# EAGLE design Camera (EAGLE 9.6.2)
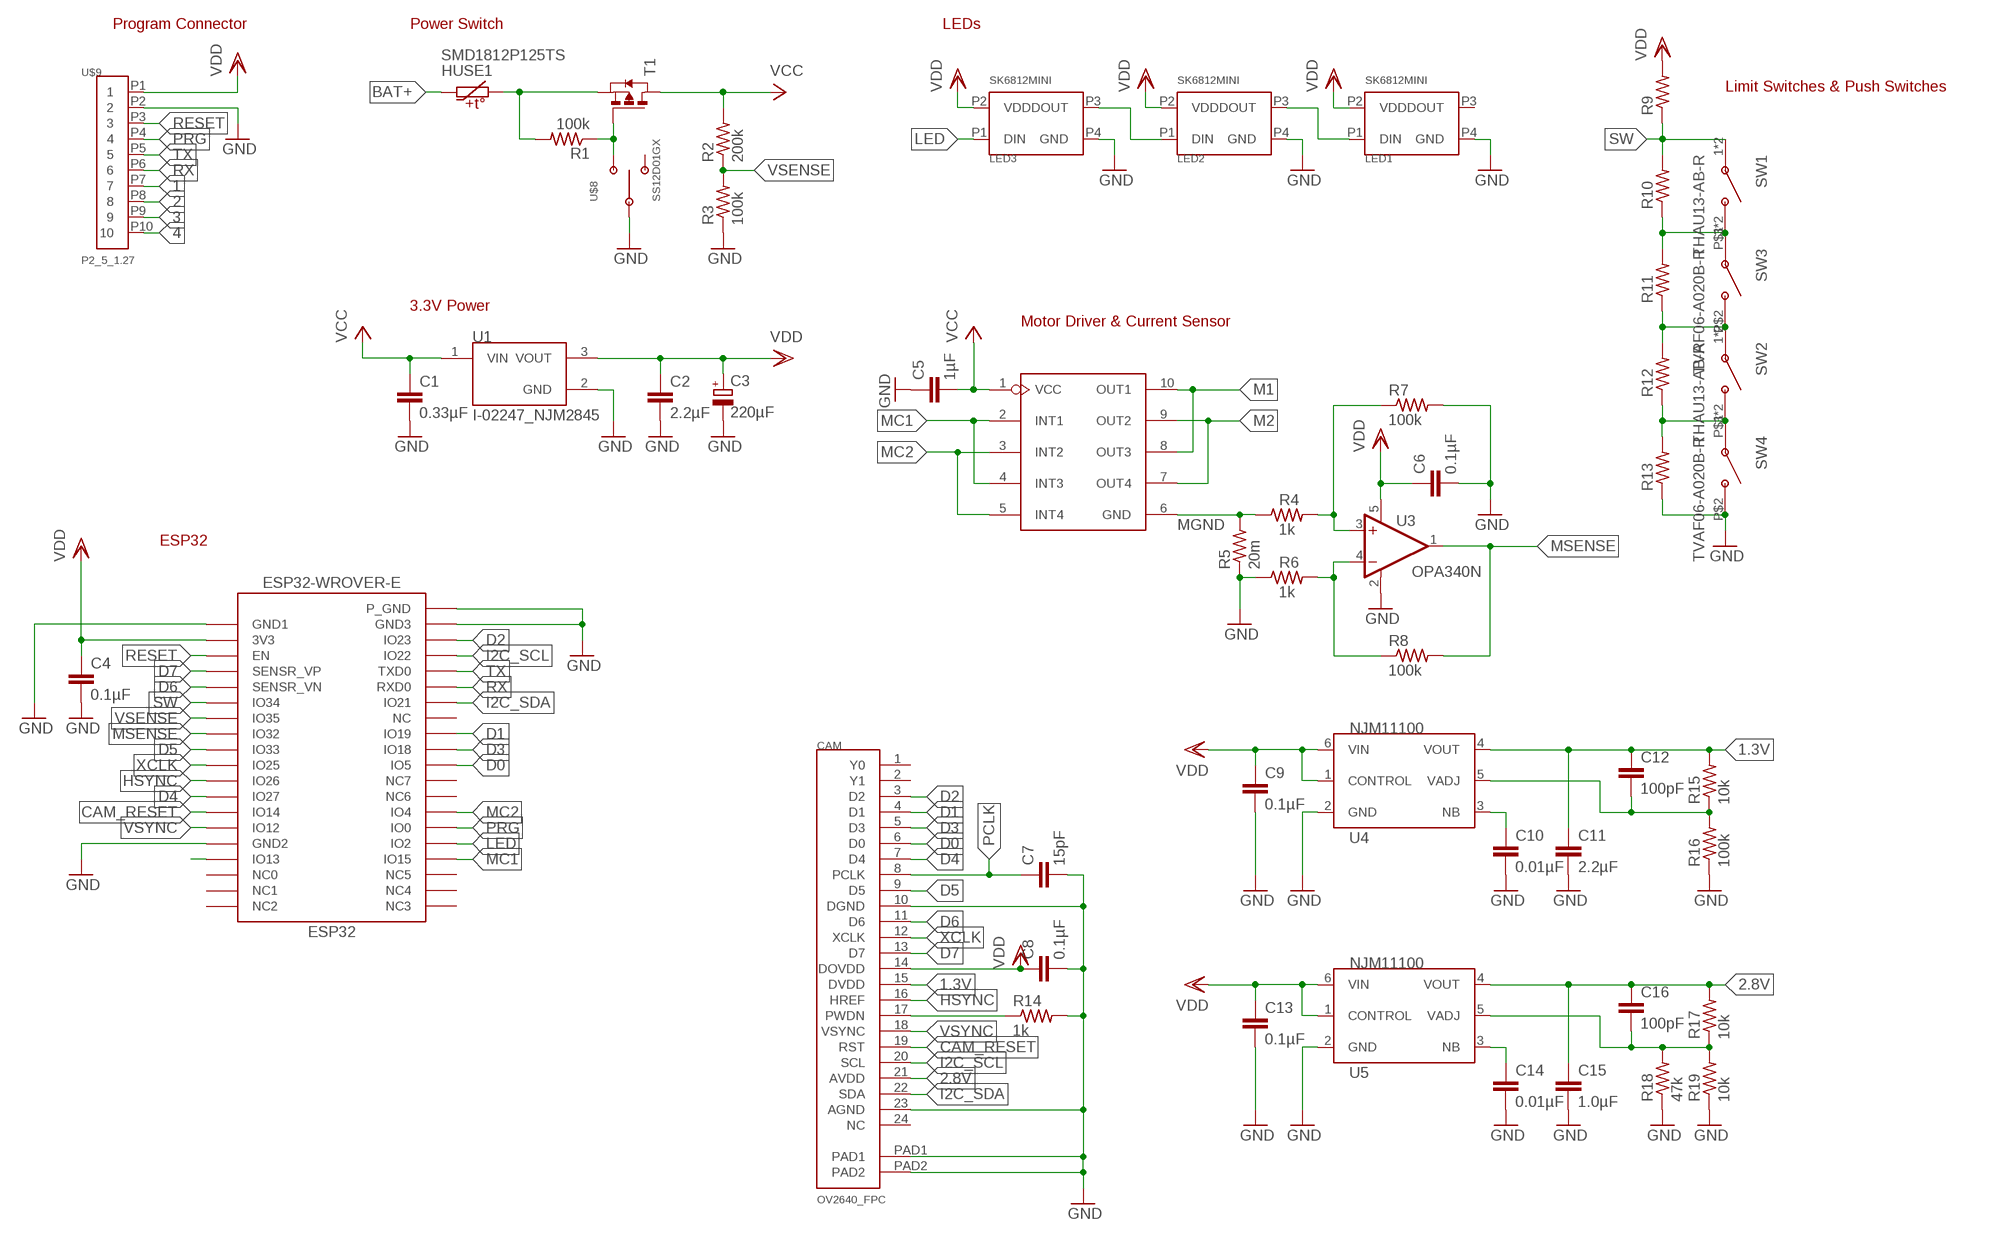
[diagram p0: schematic, sheet 1]

## Parts
C1  0.33µF  C-EUC0603  [C0603]
C2  2.2µF  C-EUC0603  [C0603]
C3  220µF  CPOL-EUUD-6,3X7,7  [UD-6,3X7,7_NICHICON]
C4  0.1µF  C-EUC0603  [C0603]
C5  1µF  C-EUC0603  [C0603]
C6  0.1µF  C-EUC0603  [C0603]
C7  15pF  C-EUC0603  [C0603]
C8  0.1µF  C-EUC0603  [C0603]
C9  0.1µF  C-EUC0603  [C0603]
C10  0.01µF  C-EUC0603  [C0603]
C11  2.2µF  C-EUC0603  [C0603]
C12  100pF  C-EUC0603  [C0603]
C13  0.1µF  C-EUC0603  [C0603]
C14  0.01µF  C-EUC0603  [C0603]
C15  1.0µF  C-EUC0603  [C0603]
C16  100pF  C-EUC0603  [C0603]
CAM  OV2640_FPC  [FH12-24S-0.5SH]
ESP32  ESP32-WROVER-E  [ESP32-WROVER-E]
HUSE1  SMD1812P125TS  [SMD1812P]
LED1  SK6812MINI  [SK68XXMINI]
LED2  SK6812MINI  [SK68XXMINI]
LED3  SK6812MINI  [SK68XXMINI]
R1  100k  R-US_R0603  [R0603]
R2  200k  R-US_R0603  [R0603]
R3  100k  R-US_R0603  [R0603]
R4  1k  R-US_R0603  [R0603]
R5  20m  R-US_R6332W  [R6332W]
R6  1k  R-US_R0603  [R0603]
R7  100k  R-US_R0603  [R0603]
R8  100k  R-US_R0603  [R0603]
R9  R-US_R0603  [R0603]
R10  R-US_R0603  [R0603]
R11  R-US_R0603  [R0603]
R12  R-US_R0603  [R0603]
R13  R-US_R0603  [R0603]
R14  1k  R-US_R0603  [R0603]
R15  10k  R-US_R0603  [R0603]
R16  100k  R-US_R0603  [R0603]
R17  10k  R-US_R0603  [R0603]
R18  47k  R-US_R0603  [R0603]
R19  10k  R-US_R0603  [R0603]
SW1  THAU13-AB-R  [THAU13-AB-R]
SW2  THAU13-AB-R  [THAU13-AB-R]
SW3  TVAF06-A020B-R  [TVAF06-A020B-R]
SW4  TVAF06-A020B-R  [TVAF06-A020B-R]
T1  PMOSSOT23  [SOT-23]
U1  I-02247_NJM2845  [TO252]
U2  DRIVER-LV8548MC-AH(SOIC10)  [SOIC10-1.0-5X4MM]
U3  OPA340N  [SOT23-5]
U4  NJM11100  [SOT95P240X110-6N]
U5  NJM11100  [SOT95P240X110-6N]
U$8  SS12D01GX  [SS12D01GX]
U$9  P2_5_1.27  [P2_5_1.27]

## Nets
1: U$9.P7
1.3V: C11.1 C12.1 CAM.15(DVDD) R15.2 U4.4(VOUT)
2: U$9.P8
2.8V: C15.1 C16.1 CAM.21(AVDD) R17.2 U5.4(VOUT)
3: U$9.P9
4: U$9.P10
BAT+: HUSE1.1
CAM_RESET: CAM.19(RST) ESP32.IO14
D0: CAM.6(D0) ESP32.IO5
D1: CAM.4(D1) ESP32.IO19
D2: CAM.3(D2) ESP32.IO23
D3: CAM.5(D3) ESP32.IO18
D4: CAM.7(D4) ESP32.IO27
D5: CAM.9(D5) ESP32.IO33
D6: CAM.11(D6) ESP32.SENSOR_VN(SENSR_VN)
D7: CAM.13(D7) ESP32.SENSOR_VP(SENSR_VP)
GND: C1.2 C2.2 C3.- C4.2 C5.1 C6.2 C7.2 C8.2 C9.2 C10.2 C11.2 C13.2 C14.2 C15.2 CAM.10(DGND) CAM.23(AGND) CAM.PAD1 CAM.PAD2 ESP32.GND1 ESP32.GND2 ESP32.GND3 ESP32.P_GND LED1.P4(GND) LED2.P4(GND) LED3.P4(GND) R3.1 R5.1 R6.1 R7.2 R13.1 R14.2 R16.1 R18.1 R19.1 SW4.P$2(B) U1.2(GND) U3.2(V-) U4.2(GND) U5.2(GND) U$8.2(C) U$9.P2
HSYNC: CAM.16(HREF) ESP32.IO26
I2C_SCL: CAM.20(SCL) ESP32.IO22
I2C_SDA: CAM.22(SDA) ESP32.IO21
LED: ESP32.IO2 LED3.P1(DIN)
M1: U2.8(OUT3) U2.10(OUT1)
M2: U2.7(OUT4) U2.9(OUT2)
MC1: ESP32.IO15 U2.2(INT1) U2.4(INT3)
MC2: ESP32.IO4 U2.3(INT2) U2.5(INT4)
MGND: R4.1 R5.2 U2.6(GND)
MSENSE: ESP32.IO32 R8.2 U3.1(OUT)
N$1: C10.1 U4.3(NB)
N$2: C12.2 R15.1 R16.2 U4.5(VADJ)
N$3: C14.1 U5.3(NB)
N$4: C16.2 R17.1 R18.2 R19.2 U5.5(VADJ)
N$7: CAM.17(PWDN) R14.1
N$10: ESP32.IO13
N$14: HUSE1.2 R1.2 T1.2(S)
N$15: R6.2 R8.1 U3.4(-IN)
N$16: R4.2 R7.1 U3.3(+IN)
N$17: R1.1 T1.3(G) U$8.1(A)
N$18: LED2.P1(DIN) LED3.P3(DOUT)
N$19: LED1.P1(DIN) LED2.P3(DOUT)
N$20: R11.1 R12.2 SW2.1(A) SW2.2(A) SW3.P$2(B)
N$21: R10.1 R11.2 SW1.3(B) SW1.4(B) SW3.P$1(A)
N$22: R12.1 R13.2 SW2.3(B) SW2.4(B) SW4.P$1(A)
PCLK: C7.1 CAM.8(PCLK)
PRG: ESP32.IO0 U$9.P4
RESET: ESP32.EN U$9.P3
RX: ESP32.RXD0 U$9.P6
SW: ESP32.IO34 R9.1 R10.2 SW1.1(A) SW1.2(A)
TX: ESP32.TXD0 U$9.P5
VCC: C1.1 C5.2 R2.2 T1.1(D) U1.1(VIN) U2.1(VCC)
VDD: C2.1 C3.+ C4.1 C6.1 C8.1 C9.1 C13.1 CAM.14(DOVDD) ESP32.3V3 LED1.P2(VDD) LED2.P2(VDD) LED3.P2(VDD) R9.2 U1.3(VOUT) U3.5(V+) U4.1(CONTROL) U4.6(VIN) U5.1(CONTROL) U5.6(VIN) U$9.P1
VSENSE: ESP32.IO35 R2.1 R3.2
VSYNC: CAM.18(VSYNC) ESP32.IO12
XCLK: CAM.12(XCLK) ESP32.IO25
Unconnected: CAM.1(Y0) CAM.2(Y1) CAM.24(NC) ESP32.IO16(NC6) ESP32.IO17(NC7) ESP32.NC ESP32.NC0 ESP32.NC1 ESP32.NC2 ESP32.NC3 ESP32.NC4 ESP32.NC5 LED1.P3(DOUT) U$8.3(B)

## Notes on the sheet
- Program Connector | Power Switch | LEDs
- Limit Switches & Push Switches
- 3.3V Power
- Motor Driver & Current Sensor
- ESP32

## Library data of the parts
C1 C2 C4-C8 = rcl:C-EU: CAPACITOR, European symbol; SPICEPREFIX: C
C3 = rcl:CPOL-EU: POLARIZED CAPACITOR, European symbol; SPICEPREFIX: C
C9-C16 = resistor:C-EU: CAPACITOR, European symbol
CAM = camera:OV2640_FPC
ESP32 = esp32:ESP32-WROVER-E
HUSE1 = ptc:SMD1812P125TS
LED1-LED3 = leds:SK6812MINI
R1-R14 = rcl:R-US_: RESISTOR, American symbol; SPICEPREFIX: R
R15-R19 = resistor:R-US_: RESISTOR, American symbol
SW1 SW2 = switches:THAU13-AB-R
SW3 SW4 = switches:TVAF06-A020B-R
T1 = zetex:PMOSSOT23: MOS FET; OC_FARNELL: unknown; OC_NEWARK: unknown
U1 = akizuki:I-02247_NJM2845
U2 = DRIVER-LV8548MC-AH_SOIC10_:DRIVER-LV8548MC-AH(SOIC10): 310030259 Check prices <https://pricing.snapeda.com/parts/LV8548MC-AH/ON%20Semiconductor/view-part?ref=eda>; AVAILABILITY: Not in stock; DESCRIPTION: Half Bridge (4) Driver DC Motors, General Purpose, Stepper Motors DMOS 10-SOIC; MF: ON Semiconductor; MP: LV8548MC-AH; PACKAGE: SOIC NB-10 ON Semiconductor; PRICE: None
U3 = burr-brown:OPA340: Rail-to-Rail Operational Amplifiers Single-Supply, MicroAmplifier(TM) Series; MPN: OPA340NA/3KG4; OC_FARNELL: 1234805; OC_NEWARK: 13M5177
U4 U5 = regulators:NJM11100
U$8 = switches:SS12D01GX
U$9 = pins:P2_5_1.27

## Board
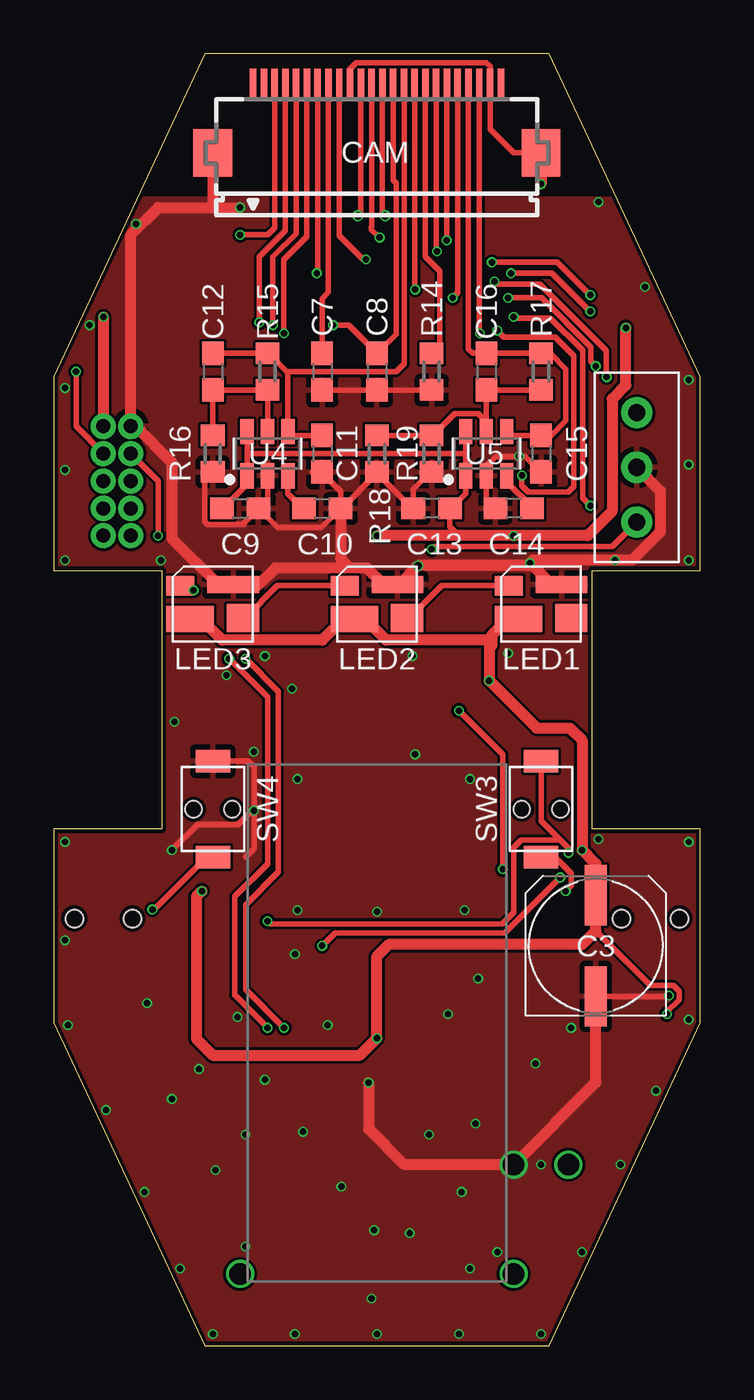
[diagram p1: board, top side]
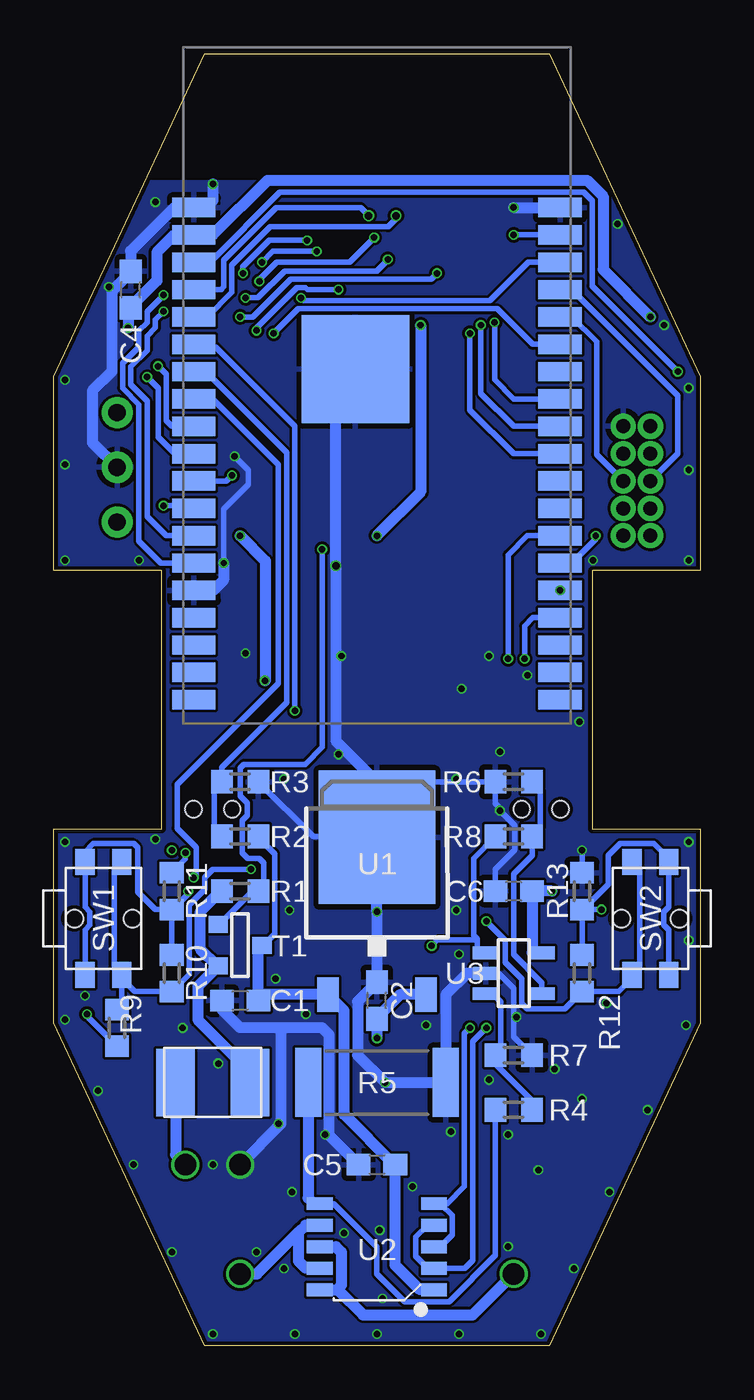
[diagram p2: board, bottom side, seen from below]

Size 30 x 60 mm. Coordinates in mm from the lower left corner, seen from the top.
Outline: 7,0 23,0 30,15 30,24 25,24 25,36 30,36 30,45 23,60 7,60 0,45 0,36 5,36 5,24 0,24 0,15 7,0
Copper layers (1*16): Top 0.035mm / dielectric 1mm / Bottom 0.035mm
Design rules "jlcpcb-2layers-1.0mm": minimum track width 5mil, minimum drill 0.3mm, track to track 5mil, track to pad 5mil, pad to pad 5mil, via to via 5mil, smd to smd 5mil, copper to edge 0.2mm, drill to drill 6mil, minimum pad ring 10mil, minimum via ring 3mil, stop-mask expansion 4mil, vias tented up to drill 0mil, thermal gap 10mil
tKeepout: area -35,27.5 to 65,32.5

### Footprints (pad centres in the part's own frame; a part is rotated, then mirrored left to right if it is on the bottom)
C0603 = smd 1.1 x 1: 1 -0.85,0; 2 0.85,0
UD-6,3X7,7_NICHICON = smd 2.8 x 1: + 2.35,0; - -2.35,0
FH12-24S-0.5SH = smd 0.3 x 1.3: 1 -5.75,3.25; 2 -5.25,3.25; 3 -4.75,3.25; 4 -4.25,3.25; 5 -3.75,3.25; 6 -3.25,3.25; 7 -2.75,3.25; 8 -2.25,3.25; 9 -1.75,3.25; 10 -1.25,3.25; 11 -0.75,3.25; 12 -0.25,3.25; 13 0.25,3.25; 14 0.75,3.25; 15 1.25,3.25; 16 1.75,3.25; 17 2.25,3.25; 18 2.75,3.25; 19 3.25,3.25; 20 3.75,3.25; 21 4.25,3.25; 22 4.75,3.25; 23 5.25,3.25; 24 5.75,3.25 | smd 1.8 x 2.2: PAD1 -7.62,0; PAD2 7.62,0
ESP32-WROVER-E = smd 2 x 0.9: 3V3 -8.5,10.16; EN -8.5,8.89; GND1 -8.5,11.43; GND2 -8.5,-6.35; GND3 8.5,11.43; IO0 8.5,-5.08; IO2 8.5,-6.35; IO4 8.5,-3.81; IO5 8.5,0; IO12 -8.5,-5.08; IO13 -8.5,-7.62; IO14 -8.5,-3.81; IO15 8.5,-7.62; IO16 8.5,-2.54; IO17 8.5,-1.27; IO18 8.5,1.27; IO19 8.5,2.54; IO21 8.5,5.08; IO22 8.5,8.89; IO23 8.5,10.16; IO25 -8.5,0; IO26 -8.5,-1.27; IO27 -8.5,-2.54; IO32 -8.5,2.54; IO33 -8.5,1.27; IO34 -8.5,5.08; IO35 -8.5,3.81; NC 8.5,3.81; NC0 -8.5,-8.89; NC1 -8.5,-10.16; NC2 -8.5,-11.43; NC3 8.5,-11.43; NC4 8.5,-10.16; NC5 8.5,-8.89; RXD0 8.5,6.35; SENSOR_VN -8.5,6.35; SENSOR_VP -8.5,7.62; TXD0 8.5,7.62 | smd 5 x 5: P_GND -1,3.93
SMD1812P = smd 1.78 x 3.15: 1 -1.725,0; 2 1.725,0
SK68XXMINI = smd 1.3 x 0.9: P1 1.5,-0.85 | smd 2.2 x 1.2: P2 1.05,0.7 | smd 1.5 x 1.3: P3 -1.4,0.65 | smd 2.4 x 0.8: P4 -0.95,-0.9
R0603 = smd 1 x 1.1: 1 -0.85,0; 2 0.85,0
R6332W = smd 1.2 x 3.2: 1 -3.196,0; 2 3.196,0
THAU13-AB-R = smd 1.2 x 0.9: 1 -2.625,0.85; 2 2.625,0.85; 3 -2.625,-0.85; 4 2.625,-0.85 | hole 0.8: 0,1.35; 0,-1.35
TVAF06-A020B-R = smd 1.6 x 1.05: P$1 0,2.225; P$2 0,-2.225 | hole 0.75: -0.9,0; 0.9,0
SOT-23 = smd 0.787 x 0.889: 1 0.025,-1.016; 2 -0.94,1.016; 3 0.991,1.016
TO252 = smd 1 x 1.6: 1 -2.28,-4.8; 3 2.28,-4.8 | smd 5.4 x 6.2: 2 0,2.5
SOIC10-1.0-5X4MM = smd 0.6 x 1.2: 1 -2,-2.65; 2 -1,-2.65; 3 0,-2.65; 4 1,-2.65; 5 2,-2.65; 6 2,2.65; 7 1,2.65; 8 0,2.65; 9 -1,2.65; 10 -2,2.65
SOT23-5 = smd 0.6 x 1.2: 1 -0.95,-1.306; 2 0,-1.306; 3 0.95,-1.306; 4 0.95,1.306; 5 -0.95,1.306
SOT95P240X110-6N = smd 1.18 x 0.609: 1 -1.024,0.95; 2 -1.024,0; 3 -1.024,-0.95; 4 1.024,-0.95; 5 1.024,0; 6 1.024,0.95
SS12D01GX = drill 0.8: 1 -2.54,0; 2 0,0; 3 2.54,0
P2_5_1.27 = drill 0.65 pad 1.016: P1 0,2.54; P2 1.27,2.54; P3 0,1.27; P4 1.27,1.27; P5 0,0; P6 1.27,0; P7 0,-1.27; P8 1.27,-1.27; P9 0,-2.54; P10 1.27,-2.54

### Placement (x,y rotation side)
C1  21.35,16.03 180 bottom
C2  15,16.03 90 bottom
C3  25.16,18.57 90 top
C4  26.43,49.05 90 bottom
C5  15,8.41 0 bottom
C6  8.65,21.11 180 bottom
C7  12.46,45.24 270 top
C8  15,45.24 270 top
C9  8.65,38.89 0 top
C10  12.46,38.89 0 top
C11  12.46,41.43 270 top
C12  7.38,45.24 270 top
C13  17.54,38.89 180 top
C14  21.35,38.89 180 top
C15  22.62,41.43 270 top
C16  20.08,45.24 270 top
CAM  15,55.4 0 top
ESP32  15,41.43 0 bottom
HUSE1  22.62,12.22 0 bottom
LED1  22.62,34.45 180 top
LED2  15,34.45 180 top
LED3  7.38,34.45 180 top
R1  21.35,21.11 180 bottom
R2  21.35,23.65 0 bottom
R3  21.35,26.19 180 bottom
R4  8.65,10.95 0 bottom
R5  15,12.22 180 bottom
R6  8.65,26.19 0 bottom
R7  8.65,13.49 0 bottom
R8  8.65,23.65 180 bottom
R9  27.06,14.76 270 bottom
R10  24.52,17.3 270 bottom
R11  24.52,21.11 270 bottom
R12  5.47,17.3 270 bottom
R13  5.47,21.11 270 bottom
R14  17.54,45.24 270 top
R15  9.92,45.24 90 top
R16  7.38,41.43 90 top
R17  22.62,45.24 90 top
R18  15,41.43 90 top
R19  17.54,41.43 90 top
SW1  27.7,19.84 270 bottom
SW2  2.3,19.84 90 bottom
SW3  22.62,24.92 180 top
SW4  7.38,24.92 180 top
T1  21.35,18.57 90 bottom
U1  15,21.11 0 bottom
U2  15,4.6 90 bottom
U3  8.65,17.3 270 bottom
U4  9.92,41.43 90 top
U5  20.08,41.43 90 top
U$8  27.06,40.8 90 top
U$9  2.3,40.16 0 top

### Tracks (layer width: path | path; a pad name or v marks a point on that pad's centre or on a via)
1.3V
  Top 0.254: C11.1 11.04,42.28 U4.4 10.87,45.19 | 10.87,45.19 9.97,46.09 R15.2 C12.1 | CAM.15 16.27,58.63 16.27,50.32 16.27,49.85 16.27,45.62 15.89,45.24 10.92,45.24 10.87,45.19
2.8V
  Top 0.254: U5.4 21.2,42.28 C15.1 23.09,42.28 23.76,42.95 23.76,45.37 23.04,46.09 R17.2 C16.1 19.45,46.09 19.25,46.28 CAM.21
BAT+  (via drill 1 pad 1.3)
  Bottom 0.508: v23.89,8.41 24.34,8.86 HUSE1.1
CAM_RESET  (via drill 0.3)
  Top 0.254: CAM.19 18.25,51.34 v18.24,51.33 | v21.22,49.81 23.13,49.81 v24.91,48.03
  Bottom 0.254: v18.24,51.33 v18.24,51.34 20,51.34 21.22,50.11 v21.22,49.81 | ESP32.IO14 24.78,37.62 25.67,38.51 25.67,43.87 26.42,44.63 26.42,45.47 25.67,46.23 25.67,46.89 25.29,47.27 25.29,47.65 v24.91,48.03
D0  (via drill 0.3)
  Top 0.254: CAM.6 11.75,51.52 10.68,50.45 v10.68,47.02
  Bottom 0.254: v10.68,47.02 10.68,43.46 8.65,41.43 ESP32.IO5
D1  (via drill 0.3)
  Top 0.254: CAM.4 10.75,51.78 9.54,50.57 v9.54,47.53
  Bottom 0.254: ESP32.IO19 8.65,43.97 9.54,44.86 v9.54,47.53
D2  (via drill 0.3)
  Top 0.254: CAM.3 10.25,51.92 9.92,51.59 v8.65,51.59
  Bottom 0.254: v8.65,51.59 ESP32.IO23
D3  (via drill 0.3)
  Top 0.254: CAM.5 11.25,51.65 10.17,50.57 v10.17,47.4
  Bottom 0.254: v10.17,47.4 10.17,44.22 8.65,42.7 ESP32.IO18
D4  (via drill 0.3)
  Top 0.254: CAM.7 12.25,49.86 v12.21,49.81 | v24.91,39.02 24.55,39.37 24.55,46.23 23.05,47.73 21.4,47.73 v21.35,47.78
  Bottom 0.254: ESP32.IO27 23.63,39.02 v24.91,39.02 | v21.35,47.78 20.75,47.78 19,49.53 12.49,49.53 v12.21,49.81
D5  (via drill 0.3)
  Top 0.254: CAM.9 13.25,51.56 14.37,50.45 v14.49,50.45 | v25.16,45.49 24.93,45.72 24.93,46.39 22.65,48.67 v21.1,48.67
  Bottom 0.254: ESP32.IO33 24.52,42.7 24.78,42.95 24.78,45.11 v25.16,45.49 | v21.1,48.67 20.53,48.67 19.29,49.91 15,49.91 | 15,49.91 14.99,49.91 | 15,49.91 14.49,50.42 v14.49,50.45
D6  (via drill 0.35)
  Top 0.254: CAM.11 14.25,52.62 v14.11,52.48
  Bottom 0.254: v14.11,52.48 14.11,52.34 14.48,51.97 19.95,51.97 21.73,50.19 21.73,48.92 22.87,47.78 ESP32.SENSOR_VN 22.87,47.78
D7  (via drill 0.35)
  Top 0.254: CAM.13 15.25,52.61 v15.38,52.48
  Bottom 0.254: 22.74,49.05 ESP32.SENSOR_VP 22.24,49.05 22.11,49.18 22.11,50.41 19.67,52.86 15.76,52.86 v15.38,52.48
GND  (via drill 0.3, 0.35, 1 pad 1.3)
  Top 0.254: C3.- 28.51,16.22 v28.55,16.26 | 8.9,22.7 9.29,23.09 v9.29,24.85 | SW4.P$2 9.03,27.14 9.29,26.88 v9.29,24.85 | v5.47,23.02 6.68,24.22 8.57,24.22 9.21,24.85 v9.29,24.85 | 8.84,38.14 8.75,38.14 | 8.75,38.14 7.14,38.14 7,38.28 7,40.2 R16.1 | 15,40.53 13.36,38.89 C10.2 | C10.2 13.31,39.68 12.46,40.53 C11.2 12,40.58 | 9.92,40.87 U4.2 9.92,39.31 C9.2 | R19.1 17.49,40.58 16.69,39.78 C13.2 16.64,38.89 15,40.53 | 15,40.53 R18.1 | C14.2 20.08,39.31 U5.2 20.08,40.87 20.51,41.3 v21.6,41.3 21.9,41.3 C15.2 22.54,40.58 | C7.2 C8.2 R14.2 | 8.75,38.14 C9.2 | C9.2 10.39,38 12.42,38 C10.2 | CAM.PAD2 21.35,55.4 20.25,56.5 CAM.23 20.25,59.42 20.08,59.59 14.03,59.59 13.75,59.31 CAM.10
  Top 0.508: LED2.P4 15.15,35.34 | LED2.P4 16.03,35.34 v16.91,36.22 21.98,36.22 v22.11,36.35 | LED1.P4 23.12,35.34 v22.11,36.35 | C3.- 25.16,12.22 v21.35,8.41 16.27,8.41 14.62,10.06 v14.62,12.22 | U$8.2 28.17,39.69 28.17,37.8 26.86,36.49 22.25,36.49 v22.11,36.35 | 7.38,52.86 4.84,52.86 3.58,51.6 3.57,51.58 U$9.P2 3.79,42.7 5.47,41.02 5.47,37.49 7.62,35.34 LED3.P4 9.51,35.34 10.29,36.13 13.73,36.13 | 7.38,52.86 v8.65,52.86 | LED2.P4 15.31,35.34 14.53,36.13 13.73,36.13 | C10.2 13.31,36.55 13.73,36.13 | CAM.PAD1 7.38,52.86 | CAM.PAD2 v22.62,53.95
  Bottom 0.254: U3.2 9.35,17.3 8.65,16.6 8.65,14.34 R7.2 | R6.1 12.42,26.19 14.96,23.65 | 14.96,23.65 U1.2 | R3.1 17.96,23.65 14.96,23.65 | R6.1 9.5,26.24 | 9.45,21.11 C6.2 9.5,22.13 8.61,23.02 8.61,24.17 v9.29,24.85 9.29,24.98 9.5,25.19 R6.1 | v5.47,23.02 R13.1 | v21.6,41.3 20.97,40.67 20.97,39.99 22.11,38.85 v22.11,36.35
  Bottom 0.508: C5.1 17.21,9.77 17.21,14.44 17.54,14.76 19.45,14.76 | 19.45,14.76 21.35,14.76 22.2,15.61 C1.2 | U3.2 10.81,17.3 11.8,16.3 R5.1 v14.62,12.22 15.89,13.49 15.89,15.99 C2.2 v15,20.16 U1.2 15,26.19 16.91,28.09 v16.91,36.22 16.91,45.36 ESP32.P_GND | v22.11,36.35 22.11,35.56 22.59,35.08 ESP32.GND2 | v8.65,52.86 ESP32.GND3 | ESP32.P_GND 15.88,45.24 | 15,44.36 ESP32.P_GND | v21.35,8.41 19.45,10.32 19.45,14.76 | v22.62,53.95 22.62,53.19 22.95,52.86 ESP32.GND1 24.41,52.86 26.43,50.84 C4.2 26.43,49.85 27.31,48.97 27.31,45.25 28.21,44.35 28.21,41.94 U$8.2
  other vias: 26.05,36.48 29.48,36.48 29.48,40.92 29.48,44.86 27.45,49.18 25.29,53.11 3.82,52.1 1.66,47.4 0.52,44.48 0.52,40.67 0.52,36.48 4.97,36.48 21.1,32.16 16.65,32.03 9.79,32.03 11.06,30.51 8.02,31.14 5.6,28.98 9.29,27.59 11.32,26.32 16.78,27.46 11.32,20.22 19.06,20.22 19.32,26.32 25.29,23.52 29.48,23.4 29.48,15.14 27.95,11.84 24.02,14.76 22.37,13.11 18.3,15.39 19.7,17.05 11.19,18.19 12.71,14.89 8.52,15.27 4.33,15.9 0.52,23.4 0.52,18.82 0.65,14.89 2.43,10.95 5.47,11.46 6.74,12.86 9.79,12.35 11.57,9.93 19.57,10.32 17.41,9.81 22.62,8.41 26.3,8.41 24.52,4.35 18.94,7.14 20.59,4.35 16.52,5.23 14.87,5.36 13.35,7.39 19.32,3.58 22.62,0.54 18.81,0.54 14.75,2.19 15,0.54 11.19,0.54 7.38,0.54 5.86,3.58 8.9,4.6 7.51,8.16 4.21,7.14 8.9,9.81
  pour Bottom: 36.59,54.13 36.59,54.13 36.59,-0.48 -4.05,-0.48 -4.05,54.13
  pour Top: 31.51,53.37 31.51,-4.29 -1.51,-4.29 -1.51,53.37
HSYNC  (via drill 0.3)
  Top 0.254: CAM.16 16.75,49.08 v16.78,49.05 | v21.73,40.41 21.73,39.96 22.04,39.65 23.89,39.65 24.14,39.91 24.14,45.98 23.27,46.84 20.89,46.84 v20.59,47.14
  Bottom 0.254: ESP32.IO26 21.98,40.16 v21.73,40.41 | v16.78,49.05 18.22,49.05 18.32,49.15 18.72,49.15 19,48.87 19,48.86 20.59,47.27 v20.59,47.14
I2C_SCL  (via drill 0.3)
  Top 0.254: CAM.20 18.75,48.9 v18.52,48.67
  Bottom 0.254: v18.52,48.67 18.39,48.54 9.76,48.54 7.98,50.32 ESP32.IO22
I2C_SDA  (via drill 0.3)
  Top 0.254: CAM.22 19.75,47.06 v19.79,47.02
  Bottom 0.254: v19.79,47.02 18.65,48.16 9.42,48.16 7.77,46.51 ESP32.IO21
LED  (via drill 0.3)
  Top 0.254: v6.49,35.08 6.28,35.3 LED3.P1
  Bottom 0.254: ESP32.IO2 v6.49,35.08
M1  (via drill 1 pad 1.3)
  Bottom 0.508: U2.8 16.91,4.6 16.65,4.35 16.65,2.82 16.87,2.6 | U2.10 16.87,2.6 | 16.87,2.6 16.81,2.6 15.63,1.43 10.55,1.43 v8.65,3.33
M2  (via drill 1 pad 1.3)
  Bottom 0.508: U2.9 18.31,3.6 18.63,3.92 18.63,5.28 | 18.63,5.28 18.31,5.6 U2.7 | v21.35,3.33 20.58,3.33 18.63,5.28
MC1  (via drill 0.3)
  Top 0.254: v9.92,14.76 8.4,16.28 8.4,20.86 9.92,22.38 9.92,30.13 v8.14,31.91
  Bottom 0.254: U2.4 12.65,5.6 13.2,5.05 13.2,4.15 12.65,3.6 U2.2 10.92,3.6 10.55,3.96 10.55,14.12 v9.92,14.76 | ESP32.IO15 7.76,33.81 8.14,33.43 v8.14,31.91
MC2  (via drill 0.3)
  Top 0.254: v8.9,31.91 10.43,30.38 10.43,22 8.9,20.48 8.9,16.54 v10.68,14.76
  Bottom 0.254: U2.3 12.05,4.6 11.5,5.15 11.5,6.05 12.05,6.6 U2.5 11.73,6.6 10.94,7.39 10.94,14.51 v10.68,14.76 | ESP32.IO4 8.02,37.62 8.9,36.73 v8.9,31.91
MGND
  Bottom 0.254: U2.6 17,6.6 15,4.6 15,3.33 13.72,2.05 11.64,2.05 9.5,4.19 R4.1
  Bottom 0.508: R5.2 18.2,6.85 17.95,6.6 U2.6
MSENSE  (via drill 0.3)
  Top 0.254: v12.46,18.57 13.06,19.17 20.93,19.17 v23.51,21.74
  Bottom 0.254: R8.2 10.52,22.63 10.52,19.06 10.34,18.88 10.34,18.84 | 10.34,18.84 10.34,18.25 U3.1 | 10.34,18.84 12.19,18.84 v12.46,18.57 | v23.51,21.74 23.38,21.87 23.38,23.14 24.27,24.03 24.27,26.06 19.57,30.76 19.57,40.92 22.62,43.97 ESP32.IO32
N$1
  Top 0.254: U4.3 10.87,39.58 11.56,38.89 C10.1
N$2
  Top 0.254: R16.2 C12.2 R15.1 U4.5
N$3
  Top 0.254: U5.3 21.03,40.12 22.2,38.95 C14.1
N$4
  Top 0.254: R18.2 R19.2 17.59,42.28 18.61,43.3 19.7,43.3 20.08,42.92 U5.5 C16.2 R17.1
N$7
  Top 0.254: CAM.17 17.25,50.57 17.92,49.9 17.92,46.47 R14.1
N$14
  Bottom 0.508: HUSE1.2 20.89,12.73 23.31,15.14 23.31,16.69 T1.2 22.42,17.63 23.19,18.41 23.19,20.17 22.25,21.11 R1.2
N$15
  Bottom 0.254: R6.2 7.42,25.81 7.42,24.03 R8.1 | R8.1 7.8,23.4 | 7.64,16.35 U3.4 7.34,16.86 8.65,18.16 8.65,21.91 7.8,22.76 R8.1
N$16
  Bottom 0.254: R4.2 7.8,11.38 9.5,13.08 R7.1 9.25,13.74 9.25,15.97 9.63,16.35 U3.3
N$17  (via drill 0.3)
  Top 0.254: U$8.1 25.92,37.11 17.67,37.11 v17.54,36.98
  Bottom 0.254: T1.3 22.32,19.56 20.77,21.11 R1.1 20.25,21.36 20.25,22.42 20.46,22.63 21.01,22.63 21.25,22.88 21.25,24.39 21.02,24.63 21.02,25.21 21.35,25.54 21.35,26.82 21.17,27 18.34,27 17.54,27.8 v17.54,36.98
N$18
  Top 0.254: LED2.P1 10.38,35.3 8.88,33.8 LED3.P3
N$19
  Top 0.254: 16.45,33.74 LED2.P3 16.5,33.8 18,35.3 LED1.P1
N$20  (via drill 0.3)
  Top 0.254: v23.89,22.89 23.89,23.11 23.51,23.49 | 23.51,23.49 22.62,24.38 SW3.P$2 | v9.92,19.71 10.05,19.59 20.81,19.59 21.35,20.12 21.35,23.14 21.7,23.49 23.51,23.49
  Bottom 0.254: R11.1 23.89,22.59 v23.89,22.89 | SW2.2 2.8,22.11 2.8,17.57 SW2.1 3.15,17.06 3.77,16.45 R12.2 6.28,15.65 8.02,15.65 8.27,15.9 8.27,17.05 9.03,17.81 9.03,18.82 v9.92,19.71
N$21  (via drill 0.3)
  Top 0.254: SW3.P$1 23.26,22.7 24.02,21.93 24.02,21.36 v23.76,21.11
  Bottom 0.254: R11.2 24.48,20.26 23.76,20.97 v23.76,21.11 | SW1.4 28.55,19.31 28.32,19.54 28.32,20.14 28.55,20.37 SW1.3 28.55,22.94 28.17,23.32 26.3,23.32 26.11,23.13 26.11,21.08 25.29,20.26 R11.2 | R10.1 R11.2
N$22  (via drill 0.3)
  Top 0.254: v4.57,20.26 4.67,20.26 7.11,22.7 SW4.P$1
  Bottom 0.254: R13.2 5.43,20.26 4.26,21.42 4.26,22.76 3.71,23.32 2.15,23.32 1.45,22.62 SW2.4 1.45,20.37 1.68,20.14 1.68,19.54 1.45,19.31 SW2.3 | R12.1 R13.2 | R13.2 v4.57,20.26
PCLK
  Top 0.254: CAM.8 12.75,48.92 12.46,48.63 C7.1
PRG  (via drill 0.3)
  Top 0.254: U$9.P4 4.84,40.16 v4.84,37.62
  Bottom 0.254: ESP32.IO0 5.95,36.35 4.84,37.46 v4.84,37.62
RESET  (via drill 0.3)
  Top 0.254: U$9.P3 1.03,42.7 v1.03,45.24
  Bottom 0.254: ESP32.EN 22.75,50.32 19.5,53.56 5.39,53.56 5.01,53.18 5.01,49.22 v1.03,45.24
RX
  Bottom 0.254: ESP32.RXD0 5.95,47.78 4.8,46.63 4.8,41.39 U$9.P6
SW  (via drill 0.3)
  Top 0.254: v20.84,22.13 20.84,27.46 v18.81,29.49
  Bottom 0.254: SW1.2 27.2,17.57 27.2,22.11 SW1.1 | SW1.2 26.85,17.06 26.23,16.45 R10.2 23.72,17.25 23.72,20.47 23,21.19 23,21.74 22.62,22.13 v20.84,22.13 | R9.1 26.85,15.82 SW1.2 | ESP32.IO34 23.37,46.38 22.49,46.38 18.81,42.7 v18.81,29.49
TX
  Bottom 0.254: U$9.P5 1.03,41.43 1.03,43.97 1.03,44.13 5.95,49.05 ESP32.TXD0
VCC
  Bottom 0.254: T1.1 20.28,18.59 19.75,19.13 19.75,22.85 20.5,23.6 R2.2
  Bottom 0.508: U2.1 13.01,2.6 14.15,3.74 C5.2 14.2,8.41 16.53,10.74 16.53,15.56 U1.1 20.22,16.31 C1.1 20.5,18.43 T1.1
VDD  (via drill 0.3)
  Top 0.254: LED3.P2 5.83,33.74 5.63,33.54 | 25.16,19.27 27.69,16.74 28.75,16.74 29.03,16.46 29.03,16.06 28.46,15.49 v28.46,15.39 | C9.1 7.85,38.89 8.97,40.01 U4.1 8.97,41.43 | 8.97,41.43 U4.6 | 19.13,41.43 U5.1 19.13,39.58 18.44,38.89 C13.1 18.39,38.04 18.81,37.62 | 19.13,41.43 U5.6 | CAM.14 15.75,54.14 15.89,54 15.89,46.98 C8.1 13.69,47.4 v12.97,47.4 | 8.97,41.43 19.13,41.43
  Top 0.508: LED1.P2 21.07,33.74 20.33,33.01 20.33,32.54 20.21,32.67 | LED3.P2 6.83,33.74 7.81,32.76 12.47,32.76 13.45,33.74 LED2.P2 14.45,33.74 15.43,32.76 20.11,32.76 20.21,32.67 | v26.56,47.27 26.56,44.61 25.92,43.97 25.92,38.76 24.78,37.62 v21.35,37.62 18.81,37.62 v15,37.62 | 20.21,32.67 v20.21,30.89 22.41,28.69 23.96,28.69 24.52,28.12 v24.52,23.02 25.16,22.38 C3.+ 25.16,19.27 24.52,18.63 15.55,18.63 15,18.09 v15,14.28 14.21,13.49 7.38,13.49 6.62,14.25 6.62,20.86 v6.87,21.11 | v2.3,47.78 U$9.P1
  Bottom 0.254: R9.2 28.46,15.31 v28.46,15.39
  Bottom 0.508: U1.3 13.92,16.31 15,15.23 C2.1 v15,14.28 | v21.35,37.62 20.18,36.45 20.18,30.92 v20.21,30.89 | v26.56,47.27 26.56,48.07 C4.1 26.43,48.25 25.21,49.47 25.21,50.78 24.41,51.59 ESP32.3V3 22.62,51.59 20.08,54.13 5.24,54.13 4.5,53.39 4.5,49.98 v2.3,47.78 | v6.87,21.11 C6.1 7.8,18.25 U3.5 | v12.97,47.4 12.97,39.65 v15,37.62
VSENSE
  Bottom 0.254: R2.1 22.55,24 22.55,25.84 R3.2 22.2,26.86 19.19,29.87 19.19,41.48 22.95,45.24 ESP32.IO35
VSYNC  (via drill 0.3)
  Top 0.254: CAM.18 17.75,50.87 v17.79,50.83 | v24.91,48.8 23.38,50.32 v20.33,50.32
  Bottom 0.254: ESP32.IO12 25.03,36.35 26.05,37.37 26.05,43.72 26.81,44.48 26.8,44.49 26.8,45.63 26.05,46.38 26.05,47.14 25.67,47.53 25.67,48.03 v24.91,48.8 | v17.79,50.83 19.83,50.83 v20.33,50.32
XCLK  (via drill 0.3)
  Top 0.254: CAM.12 14.75,51.98 14.75,51.97 14.75,51.84 v15.13,51.46 | v25.67,44.99 25.64,45.01 25.64,46.22 22.55,49.3 20.59,49.3 v20.46,49.43
  Bottom 0.254: ESP32.IO25 24.4,41.43 25.16,42.19 25.16,44.48 v25.67,44.99 | v20.46,49.43 20.46,49.51 19.66,50.32 16.27,50.32 v15.13,51.46

### Text on the board
tStop: 2022 WASA Rocket